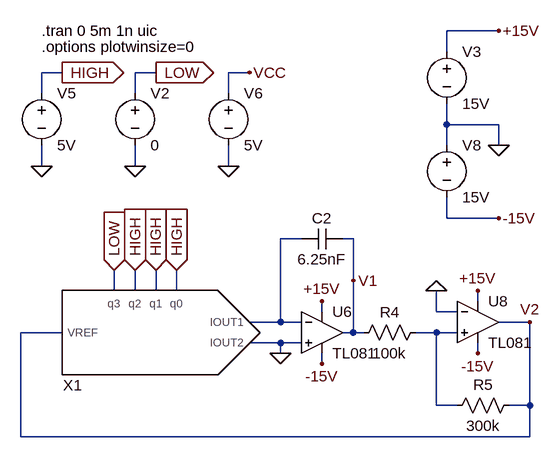
[diagram p0: schematic schema3.asc]
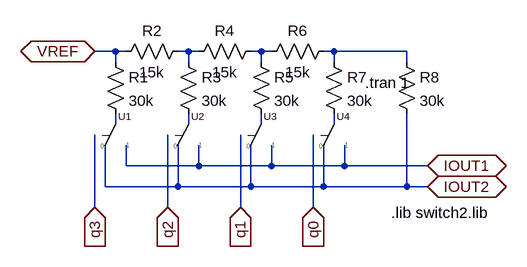
[diagram p1: sub-circuit dac4_r2r.asc]
schema3.asc, the LTspice schematic file:
Version 4
SHEET 1 1416 1648
WIRE 608 656 528 656
WIRE 528 688 528 656
WIRE -64 720 -96 720
WIRE 80 720 48 720
WIRE 224 720 192 720
WIRE -96 752 -96 720
WIRE 48 752 48 720
WIRE 192 752 192 720
WIRE 528 800 528 768
WIRE 608 800 528 800
WIRE 528 832 528 800
WIRE 608 832 608 800
WIRE -96 864 -96 832
WIRE 48 864 48 832
WIRE 192 864 192 832
WIRE 528 944 528 912
WIRE 608 944 528 944
WIRE 304 976 272 976
WIRE 384 976 368 976
WIRE 384 1040 384 976
WIRE 16 1056 16 1024
WIRE 48 1056 48 1024
WIRE 80 1056 80 1024
WIRE 112 1056 112 1024
WIRE 576 1072 576 1056
WIRE 336 1088 336 1072
WIRE 512 1088 512 1056
WIRE 544 1088 512 1088
WIRE 272 1104 272 976
WIRE 272 1104 224 1104
WIRE 304 1104 272 1104
WIRE 656 1104 608 1104
WIRE -64 1120 -128 1120
WIRE 384 1120 384 1040
WIRE 384 1120 368 1120
WIRE 400 1120 384 1120
WIRE 512 1120 480 1120
WIRE 544 1120 512 1120
WIRE 272 1136 224 1136
WIRE 304 1136 272 1136
WIRE 272 1152 272 1136
WIRE 576 1152 576 1136
WIRE 336 1168 336 1152
WIRE 512 1232 512 1120
WIRE 544 1232 512 1232
WIRE 656 1232 656 1104
WIRE 656 1232 624 1232
WIRE -128 1280 -128 1120
WIRE 656 1280 656 1232
WIRE 656 1280 -128 1280
FLAG 48 864 0
FLAG 80 720 LOW
IOPIN 80 720 Out
FLAG 192 864 0
FLAG 224 720 VCC
FLAG -96 864 0
FLAG -64 720 HIGH
IOPIN -64 720 Out
FLAG 272 1152 0
FLAG 512 1056 0
FLAG 336 1072 +15V
FLAG 576 1056 +15V
FLAG 576 1152 -15V
FLAG 336 1168 -15V
FLAG 608 656 +15V
FLAG 608 944 -15V
FLAG 608 832 0
FLAG 16 1024 LOW
IOPIN 16 1024 In
FLAG 48 1024 HIGH
IOPIN 48 1024 In
FLAG 80 1024 HIGH
IOPIN 80 1024 In
FLAG 112 1024 HIGH
IOPIN 112 1024 In
FLAG 384 1040 V1
FLAG 656 1104 V2
SYMBOL voltage 48 736 R0
SYMATTR InstName V2
SYMATTR Value 0
SYMBOL voltage 192 736 R0
WINDOW 123 0 0 Left 0
WINDOW 39 0 0 Left 0
SYMATTR InstName V6
SYMATTR Value 5V
SYMBOL voltage -96 736 R0
WINDOW 123 0 0 Left 0
WINDOW 39 0 0 Left 0
SYMATTR InstName V5
SYMATTR Value 5V
SYMBOL dac4_R2R 64 1120 R0
SYMATTR InstName X1
SYMBOL TL081 336 1056 R0
SYMATTR InstName U6
SYMBOL TL081 576 1040 R0
SYMATTR InstName U8
SYMBOL voltage 528 672 R0
WINDOW 123 0 0 Left 0
WINDOW 39 0 0 Left 0
SYMATTR InstName V3
SYMATTR Value 15V
SYMBOL voltage 528 816 R0
WINDOW 123 0 0 Left 0
WINDOW 39 0 0 Left 0
SYMATTR InstName V8
SYMATTR Value 15V
SYMBOL cap 368 960 R90
WINDOW 0 0 32 VBottom 0
WINDOW 3 32 32 VTop 0
SYMATTR InstName C2
SYMATTR Value 6.25nF
SYMBOL res 496 1104 R90
WINDOW 0 0 56 VBottom 0
WINDOW 3 32 56 VTop 0
SYMATTR InstName R4
SYMATTR Value 100k
SYMBOL res 640 1216 R90
WINDOW 0 0 56 VBottom 0
WINDOW 3 32 56 VTop 0
SYMATTR InstName R5
SYMATTR Value 300k
TEXT -96 656 Left 0 !.tran 0 5m 1n uic
TEXT -96 680 Left 0 !.options plotwinsize=0

dac4_r2r.asc, the sub-circuit schematic file:
Version 4
SHEET 1 880 680
WIRE 128 112 96 112
WIRE 144 112 128 112
WIRE 240 112 224 112
WIRE 256 112 240 112
WIRE 352 112 336 112
WIRE 368 112 352 112
WIRE 464 112 448 112
WIRE 576 112 464 112
WIRE 128 128 128 112
WIRE 240 128 240 112
WIRE 352 128 352 112
WIRE 464 128 464 112
WIRE 576 128 576 112
WIRE 128 224 128 208
WIRE 240 224 240 208
WIRE 352 224 352 208
WIRE 464 224 464 208
WIRE 144 288 144 256
WIRE 256 288 256 256
WIRE 256 288 144 288
WIRE 368 288 368 256
WIRE 368 288 256 288
WIRE 480 288 480 256
WIRE 480 288 368 288
WIRE 608 288 480 288
WIRE 112 320 112 256
WIRE 224 320 224 256
WIRE 224 320 112 320
WIRE 336 320 336 256
WIRE 336 320 224 320
WIRE 448 320 448 256
WIRE 448 320 336 320
WIRE 576 320 576 208
WIRE 576 320 448 320
WIRE 608 320 576 320
WIRE 96 352 96 240
WIRE 208 352 208 240
WIRE 320 352 320 240
WIRE 432 352 432 240
FLAG 96 112 VREF
IOPIN 96 112 BiDir
FLAG 608 288 IOUT1
IOPIN 608 288 BiDir
FLAG 608 320 IOUT2
IOPIN 608 320 BiDir
FLAG 432 352 q0
IOPIN 432 352 In
FLAG 320 352 q1
IOPIN 320 352 In
FLAG 208 352 q2
IOPIN 208 352 In
FLAG 96 352 q3
IOPIN 96 352 In
SYMBOL res 112 112 R0
SYMATTR InstName R1
SYMATTR Value 30k
SYMBOL res 240 96 R90
WINDOW 0 0 56 VBottom 2
WINDOW 3 32 56 VTop 2
SYMATTR InstName R2
SYMATTR Value 15k
SYMBOL res 240 128 R270
WINDOW 0 32 56 VTop 2
WINDOW 3 0 56 VBottom 2
SYMATTR InstName R4
SYMATTR Value 15k
SYMBOL res 464 96 R90
WINDOW 0 0 56 VBottom 2
WINDOW 3 32 56 VTop 2
SYMATTR InstName R6
SYMATTR Value 15k
SYMBOL res 224 112 R0
SYMATTR InstName R3
SYMATTR Value 30k
SYMBOL res 336 112 R0
SYMATTR InstName R5
SYMATTR Value 30k
SYMBOL res 448 112 R0
SYMATTR InstName R7
SYMATTR Value 30k
SYMBOL res 560 112 R0
SYMATTR InstName R8
SYMATTR Value 30k
SYMBOL switch2 128 240 R0
SYMATTR InstName U1
SYMBOL switch2 240 240 R0
SYMATTR InstName U2
SYMBOL switch2 352 240 R0
SYMATTR InstName U3
SYMBOL switch2 464 240 R0
SYMATTR InstName U4
TEXT 552 360 Left 2 !.lib switch2.lib
TEXT 512 160 Left 2 !.tran 1

The netlist it stands for:
* schema3.asc
V2 LOW 0 0
V6 VCC 0 5V
V5 HIGH 0 5V
XX1 V2 N001 0 HIGH HIGH HIGH LOW dac4_r2r
* U6: TL081 (symbol TL081 not available, pins judged from their places): In+=0 In-=N001 V+=+15V V-=-15V OUT=V1
* U8: TL081 (symbol TL081 not available, pins judged from their places): In+=N002 In-=0 V+=+15V V-=-15V OUT=V2
V3 +15V 0 15V
V8 0 -15V 15V
C2 V1 N001 6.25nF
R4 N002 V1 100k
R5 V2 N002 300k

* block symbol definitions
.subckt dac4_r2r VREF IOUT1 IOUT2 q0 q1 q2 q3
R1 VREF N004 30k
R2 N001 VREF 15k
R4 N001 N002 15k
R6 N003 N002 15k
R3 N001 N005 30k
R5 N002 N006 30k
R7 N003 N007 30k
R8 N003 IOUT2 30k
XU1 N004 IOUT2 IOUT1 q3 switch2  ; pins p1 p2 p3 bit
XU2 N005 IOUT2 IOUT1 q2 switch2  ; pins p1 p2 p3 bit
XU3 N006 IOUT2 IOUT1 q1 switch2  ; pins p1 p2 p3 bit
XU4 N007 IOUT2 IOUT1 q0 switch2  ; pins p1 p2 p3 bit
.lib switch2.lib
.tran 1
.ends dac4_r2r

.tran 0 5m 1n uic
.options plotwinsize=0
.backanno
.end